# Altium schematic sheet VL53L.SchDoc
size A; SheetNumber: 5; SheetTotal: 5
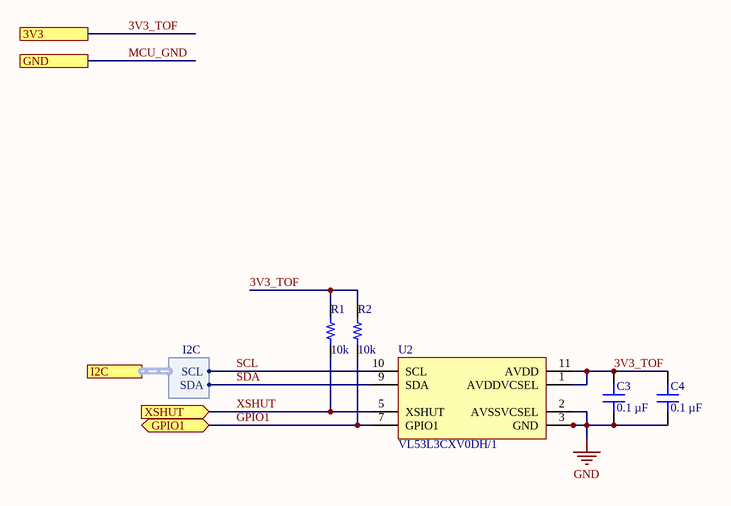
[diagram p0: VL53L.SchDoc]

## Parts
C3  0.1 µF  [CAP 0402_1005]
C4  0.1 µF  [CAP 0402_1005]
R1  10k  [RES 0402_1005]
R2  10k  [RES 0402_1005]
U2  VL53L3CXV0DH/1  [XDCR_VL53L3CXV0DH/1]

## Ports
3V3, GND, GPIO1 (bidir), I2C (harness I2C), XSHUT (in)

## Harnesses
I2C: SCL, SDA

## Nets
GND: C3.1 C4.1 U2.2(AVSSVCSEL) U2.3(GND) U2.4(GND) U2.6(GND) U2.12(GND)
3V3_TOF: C3.2 C4.2 R1.1 R2.1 U2.1(AVDDVCSEL) U2.11(AVDD) ; port 3V3
GPIO1: R2.2 U2.7(GPIO1) ; port GPIO1
MCU_GND: port GND
SCL: U2.10(SCL) ; port I2C.SCL
SDA: U2.9(SDA) ; port I2C.SDA
XSHUT: R1.2 U2.5(XSHUT) ; port XSHUT

## Library data of the parts
C3 C4 = C0402C104K4RACAUTO: CAP CER 0.1UF 16V X7R 0402; manufacturer: KEMET; Tolerance: ±10%; Part Number: C0402C104K4RACAUTO; Value: 0.1 µF; Applications: Automotive, Bypass, Decoupling; Capacitance: 0.1 µF; componentlink1description: Datasheet; componentlink1url: https://api.kemet.com/component-edge/download/specsheet/C0402C104K4RACAUTO.pdf; componentlink2description: DigiKey Link; componentlink2url: https://www.digikey.com/en/products/detail/kemet/C0402C104K4RACAUTO/3314827; Device Package: 0402 (1005 Metric); lastupdated: 8/14/2022 9:05:51 PM; Lifecycle Status: Active; Minimum Order: 1; Mounting Type: Surface Mount, MLCC; Operating Temperature: -55°C ~ 125°C; Package / Case: 0402 (1005 Metric); packaging: TapeAndReel; partid: 3024; Part Status: Active; price: 0.01; Ratings: AEC-Q200; series: SMD Auto X7R; Size / Dimension: 0.039" L x 0.020" W (1.00mm x 0.50mm); Supplier 1: DigiKey; Supplier Part Number 1: 399-6828-1-ND; Temperature Coefficient: X7R; Thickness (Max): 0.022" (0.55mm); Voltage - Rated: 16V
R1 R2 = CRCW0402330RJNEDC: RES 330 OHM 5% 1/16W 0402; Manufacturer: Vishay Dale; Power (Watts): 0.063W, 1/16W; Resistance: 330 Ohms; Temperature Coefficient: ±200ppm/°C; Part Number: CRCW0402330RJNEDC; Value: 10k; ComponentLink1Description: Datasheet; ComponentLink1URL: http://www.vishay.com/docs/28773/crcwce3.pdf; ComponentLink2Description: DigiKey Link; ComponentLink2URL: https://www.digikey.com/en/products/detail/vishay-dale/CRCW0402330RJNEDC/7928545; Composition: Thick Film; Device Package: 0402 (1005 Metric); Height - Seated (Max): 0.014" (0.35mm); LastUpdated: 8/14/2022 9:23:31 PM; Lifecycle Status: Active; Minimum Order: 1; Number of Terminations: 2; Operating Temperature: -55°C ~ 155°C; Package / Case: 0402 (1005 Metric); Packaging: CutTape; PartId: 15989; Part Status: Active; Price: 0.01; Series: CRCW-C; Size / Dimension: 0.039" L x 0.020" W (1.00mm x 0.50mm); Supplier 1: DigiKey; Supplier Part Number 1: 541-4123-1-ND; Supplier Device Package: 0402; Tolerance: ±5%
U2 = VL53L3CXV0DH/1: Optical Sensor 118.110 (3m) I2C Output; MF: STMicroelectronics; Value: *; Availability: Unavailable; Package: None; SnapEDA_Link: https://www.snapeda.com/parts/VL53L3CXV0DH/1/STMicroelectronics/view-part/4775788/?ref=snap; MP: VL53L3CXV0DH/1; Price: None